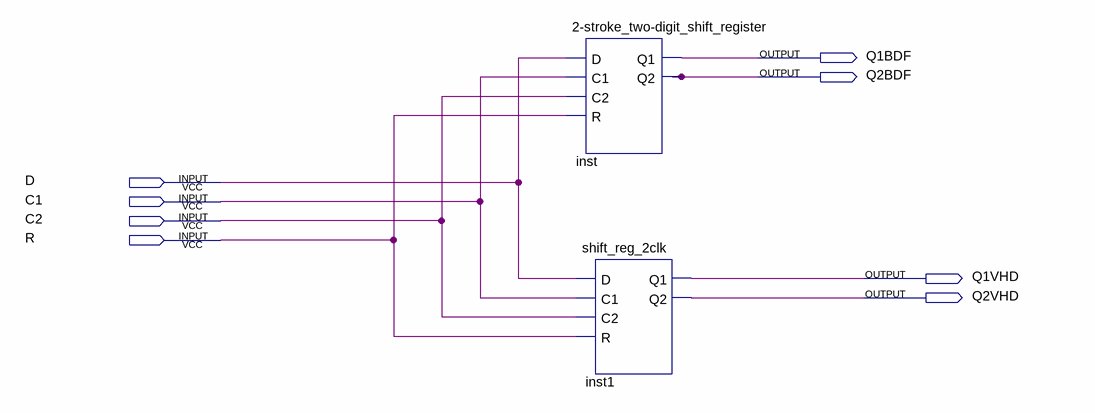
[diagram p0: schematic sheet]
// Quartus schematic 913.bdf as structural Verilog: 2 symbols, 8 pins
module \913  (
  input  D,
  input  C1,
  input  C2,
  input  R,
  output Q1BDF,
  output Q2BDF,
  output Q1VHD,
  output Q2VHD
);

  \2-stroke_two-digit_shift_register  inst (.D(D), .C1(C1), .C2(C2), .R(R), .Q1(Q1BDF), .Q2(Q2BDF));
  shift_reg_2clk inst1 (.D(D), .C1(C1), .C2(C2), .R(R), .Q1(Q1VHD), .Q2(Q2VHD));
endmodule
